# EAGLE design ap (EAGLE 6.0)
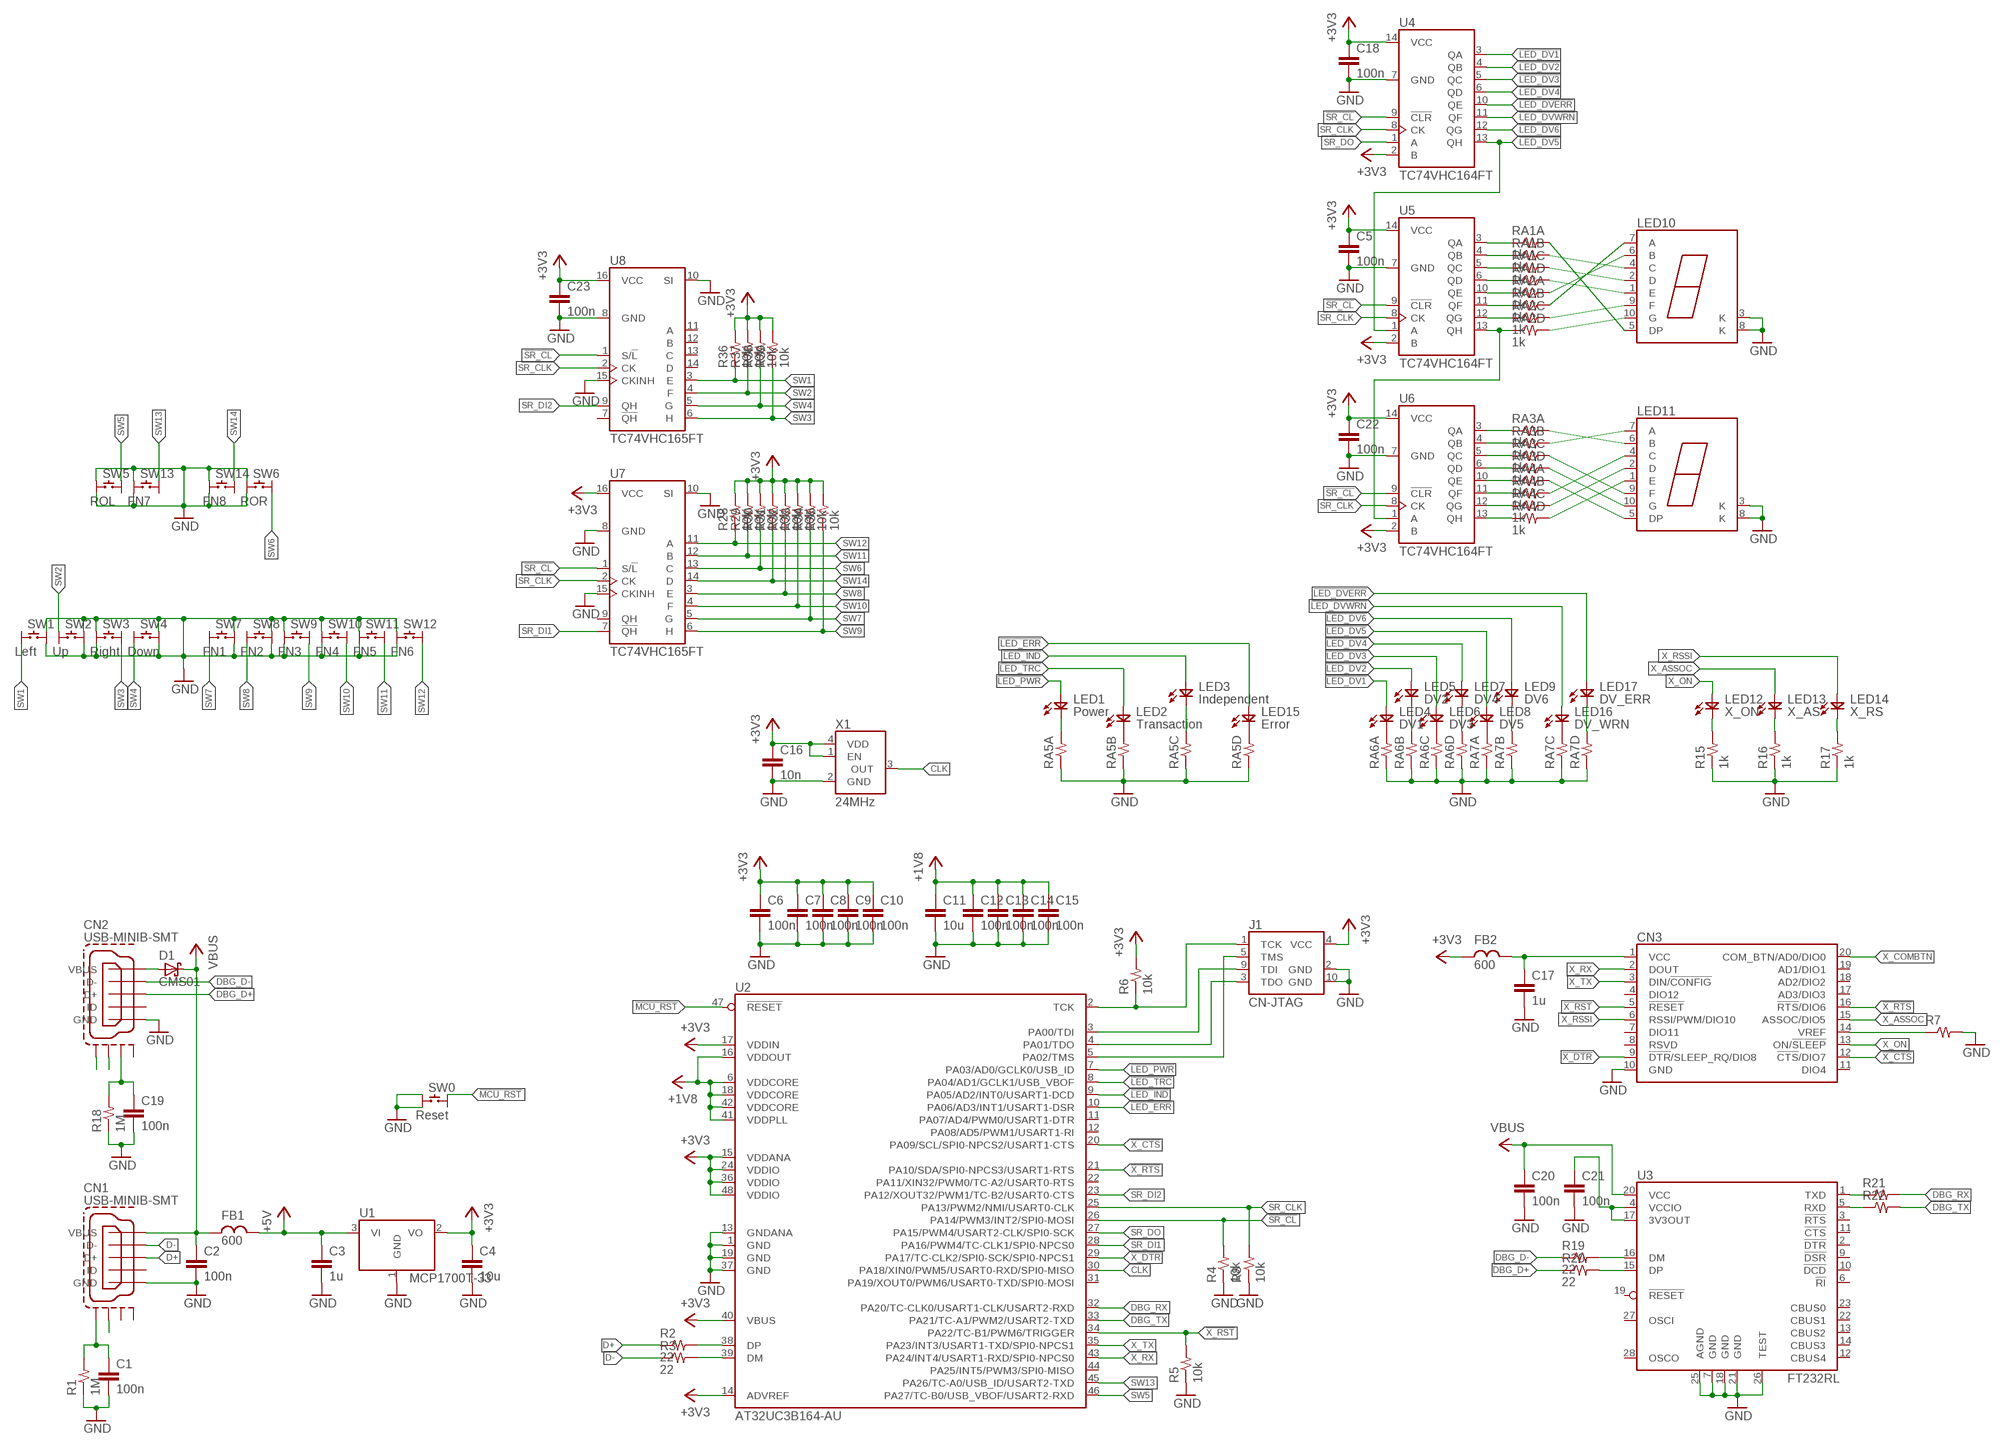
[diagram p0: schematic, sheet 1]

## Parts
C1  100n  C1608  [1608]
C2  100n  C1608  [1608]
C3  1u  C1608  [1608]
C4  10u  C2012  [2012]
C5  100n  C1005  [1005]
C6  100n  C1005  [1005]
C7  100n  C1005  [1005]
C8  100n  C1005  [1005]
C9  100n  C1005  [1005]
C10  100n  C1005  [1005]
C11  10u  C2012  [2012]
C12  100n  C1005  [1005]
C13  100n  C1005  [1005]
C14  100n  C1005  [1005]
C15  100n  C1005  [1005]
C16  10n  C1005  [1005]
C17  1u  C1608  [1608]
C18  100n  C1005  [1005]
C19  100n  C1608  [1608]
C20  100n  C1608  [1608]
C21  100n  C1608  [1608]
C22  100n  C1005  [1005]
C23  100n  C1005  [1005]
CN1  USB-MINIB-SMT  [USB-MINIB-SMT]
CN2  USB-MINIB-SMT  [USB-MINIB-SMT]
CN3  XBEE-SMT  [XBEE-SMT]
D1  CMS01  [3-4E1A]
FB1  600  FB1608  [1608]
FB2  600  FB1608  [1608]
J1  CN-JTAG  CN-JTAG_ALTERA  [PIN2X5]
LED1  Power  LED1608  [LED1608]
LED2  Transaction  LED1608  [LED1608]
LED3  Independent  LED1608  [LED1608]
LED4  DV1  LED1608  [LED1608]
LED5  DV2  LED1608  [LED1608]
LED6  DV3  LED1608  [LED1608]
LED7  DV4  LED1608  [LED1608]
LED8  DV5  LED1608  [LED1608]
LED9  DV6  LED1608  [LED1608]
LED10  ACSC02  [ACSC02]
LED11  ACSC02  [ACSC02]
LED12  X_ON  LED1608  [LED1608]
LED13  X_AS  LED1608  [LED1608]
LED14  X_RS  LED1608  [LED1608]
LED15  Error  LED1608  [LED1608]
LED16  DV_WRN  LED1608  [LED1608]
LED17  DV_ERR  LED1608  [LED1608]
R1  1M  R1608  [1608]
R2  22  R1608  [1608]
R3  22  R1608  [1608]
R4  10k  R1005  [1005]
R5  10k  R1005  [1005]
R6  10k  R1005  [1005]
R7  R1608  [1608]
R8  10k  R1005  [1005]
R15  1k  R1608  [1608]
R16  1k  R1608  [1608]
R17  1k  R1608  [1608]
R18  1M  R1608  [1608]
R19  22  R1608  [1608]
R20  22  R1608  [1608]
R21  R1608  [1608]
R22  R1608  [1608]
R28  10k  R1005  [1005]
R29  10k  R1005  [1005]
R30  10k  R1005  [1005]
R31  10k  R1005  [1005]
R32  10k  R1005  [1005]
R33  10k  R1005  [1005]
R34  10k  R1005  [1005]
R35  10k  R1005  [1005]
R36  10k  R1005  [1005]
R37  10k  R1005  [1005]
R38  10k  R1005  [1005]
R39  10k  R1005  [1005]
RA1  1k  RA4  [1005-A4]
RA2  1k  RA4  [1005-A4]
RA3  1k  RA4  [1005-A4]
RA4  1k  RA4  [1005-A4]
RA5  RA4  [1005-A4]
RA6  RA4  [1005-A4]
RA7  RA4  [1005-A4]
SW0  Reset  TACT4P-SMT6660  [TACT4P-SMT6660]
SW1  Left  TACT4P-SMT-6660  [TACT4P-SMT-6660]
SW2  Up  TACT4P-SMT-6660  [TACT4P-SMT-6660]
SW3  Right  TACT4P-SMT-6660  [TACT4P-SMT-6660]
SW4  Down  TACT4P-SMT-6660  [TACT4P-SMT-6660]
SW5  ROL  TACT4P-SMT-4735R  [TACT4P-SMT-4735R]
SW6  ROR  TACT4P-SMT-4735R  [TACT4P-SMT-4735R]
SW7  FN1  TACT4P-SMT-6660  [TACT4P-SMT-6660]
SW8  FN2  TACT4P-SMT-6660  [TACT4P-SMT-6660]
SW9  FN3  TACT4P-SMT-6660  [TACT4P-SMT-6660]
SW10  FN4  TACT4P-SMT-6660  [TACT4P-SMT-6660]
SW11  FN5  TACT4P-SMT-6660  [TACT4P-SMT-6660]
SW12  FN6  TACT4P-SMT-6660  [TACT4P-SMT-6660]
SW13  FN7  TACT4P-SMT-4735R  [TACT4P-SMT-4735R]
SW14  FN8  TACT4P-SMT-4735R  [TACT4P-SMT-4735R]
U1  MCP1700T-33  [SOT23-3]
U2  AT32UC3B164-AU  [QFP48-0.5]
U3  FT232RL  [SSOP28]
U4  TC74VHC164FT  [TSSOP14]
U5  TC74VHC164FT  [TSSOP14]
U6  TC74VHC164FT  [TSSOP14]
U7  TC74VHC165FT  [TSSOP16]
U8  TC74VHC165FT  [TSSOP16]
X1  24MHz  ASDM  [OSC2520]

## Nets
!LED_DV1: LED4.A U4.3(QA)
!LED_DV2: LED5.A U4.4(QB)
!LED_DV3: LED6.A U4.5(QC)
!LED_DV4: LED7.A U4.6(QD)
!LED_DV5: LED8.A U4.13(QH) U5.1(A)
!LED_DV6: LED9.A U4.12(QG)
!LED_DVERR: LED17.A U4.10(QE)
!LED_DVWRN: LED16.A U4.11(QF)
!LED_ERR: LED15.A U2.10(PA06/AD3/INT1/USART1-DSR)
!LED_IND: LED3.A U2.9(PA05/AD2/INT0/USART1-DCD)
!LED_PWR: LED1.A U2.7(PA03/AD0/GCLK0/USB_ID)
!LED_TRC: LED2.A U2.8(PA04/AD1/GCLK1/USB_VBOF)
!MCU_RST: SW0.B1 U2.47(!RESET)
!SR_CL: R4.2 U2.26(PA14/PWM3/INT2/SPI0-MOSI) U4.9(!CLR) U5.9(!CLR) U6.9(!CLR) U7.1(S/!L) U8.1(S/!L)
!X_CTS: CN3.12(!CTS!/DIO7) U2.20(PA09/SCL/SPI0-NPCS2/USART1-CTS)
!X_DTR: CN3.9(!DTR!/SLEEP_RQ/DIO8) U2.29(PA17/TC-CLK2/SPI0-SCK/SPI0-NPCS1)
!X_RST: CN3.5(!RESET) R5.2 U2.34(PA22/TC-B1/PWM6/TRIGGER)
!X_RTS: CN3.16(!RTS!/DIO6) U2.21(PA10/SDA/SPI0-NPCS3/USART1-RTS)
+1V8: C11.1 C12.1 C13.1 C14.1 C15.1 U2.6(VDDCORE) U2.16(VDDOUT) U2.18(VDDCORE) U2.41(VDDPLL) U2.42(VDDCORE)
+3V3: C4.1 C5.1 C6.1 C7.1 C8.1 C9.1 C10.1 C16.1 C18.1 C22.1 C23.1 FB2.1 J1.4(VCC) R6.2 R28.2 R29.2 R30.2 R31.2 R32.2 R33.2 R34.2 R35.2 R36.2 R37.2 R38.2 R39.2 U1.2(VO) U2.14(ADVREF) U2.15(VDDANA) U2.17(VDDIN) U2.24(VDDIO) U2.36(VDDIO) U2.40(VBUS) U2.48(VDDIO) U4.2(B) U4.14(VCC) U5.2(B) U5.14(VCC) U6.2(B) U6.14(VCC) U7.16(VCC) U8.16(VCC) X1.1(EN) X1.4(VDD)
+5V: C3.1 FB1.2 U1.3(VI)
CLK: U2.30(PA18/XIN0/PWM5/USART0-RXD/SPI0-MISO) X1.3(OUT)
D+: CN1.3(D+) R2.1
D-: CN1.2(D-) R3.1
DBG_D+: CN2.3(D+) R20.1
DBG_D-: CN2.2(D-) R19.1
DBG_RX: R21.2 U2.32(PA20/TC-CLK0/USART1-CLK/USART2-RXD)
DBG_TX: R22.2 U2.33(PA21/TC-A1/PWM2/USART2-TXD)
GND: C1.2 C2.2 C3.2 C4.2 C5.2 C6.2 C7.2 C8.2 C9.2 C10.2 C11.2 C12.2 C13.2 C14.2 C15.2 C16.2 C17.2 C18.2 C19.2 C20.2 C21.2 C22.2 C23.2 CN1.5(GND) CN2.5(GND) CN3.10(GND) J1.2(GND) J1.10(GND) LED10.3(K) LED10.8(K) LED11.3(K) LED11.8(K) R1.1 R4.1 R5.1 R7.2 R8.1 R15.1 R16.1 R17.1 R18.1 RA5.A1 RA5.B1 RA5.C1 RA5.D1 RA6.A1 RA6.B1 RA6.C1 RA6.D1 RA7.A1 RA7.B1 RA7.C1 RA7.D1 SW0.A1 SW0.A2 SW1.B1 SW1.B2 SW2.B1 SW2.B2 SW3.A1 SW3.A2 SW4.B1 SW4.B2 SW5.A1 SW5.A2 SW6.A1 SW6.A2 SW7.B1 SW7.B2 SW8.B1 SW8.B2 SW9.A1 SW9.A2 SW10.A1 SW10.A2 SW11.A1 SW11.A2 SW12.A1 SW12.A2 SW13.A1 SW13.A2 SW14.A1 SW14.A2 U1.1(GND) U2.1(GND) U2.13(GNDANA) U2.19(GND) U2.37(GND) U3.7(GND) U3.18(GND) U3.21(GND) U3.25(AGND) U3.26(TEST) U4.7(GND) U5.7(GND) U6.7(GND) U7.8(GND) U7.10(SI) U7.15(CKINH) U8.8(GND) U8.10(SI) U8.15(CKINH) X1.2(GND)
N$1: R2.2 U2.38(DP)
N$2: C1.1 CN1.S1 R1.2
N$3: R21.1 U3.1(TXD)
N$4: R3.2 U2.39(DM)
N$5: LED10.6(B) RA2.A2
N$6: CN3.14(VREF) R7.1
N$7: LED10.7(A) RA2.B2
N$8: J1.1(TCK) R6.1 U2.2(TCK)
N$9: J1.9(TDI) U2.3(PA00/TDI)
N$10: LED9.C RA7.B2
N$11: LED10.9(F) RA2.C2
N$12: LED2.C RA5.B2
N$13: LED1.C RA5.A2
N$14: LED4.C RA6.A2
N$15: LED5.C RA6.B2
N$16: LED6.C RA6.C2
N$17: R22.1 U3.5(RXD)
N$18: LED7.C RA6.D2
N$19: LED8.C RA7.A2
N$20: LED12.C R15.2
N$21: LED13.C R16.2
N$22: LED14.C R17.2
N$23: R19.2 U3.16(DM)
N$24: R20.2 U3.15(DP)
N$25: C21.1 U3.4(VCCIO) U3.17(3V3OUT)
N$26: CN2.1(VBUS) D1.A
N$27: J1.3(TDO) U2.4(PA01/TDO)
N$28: C19.1 CN2.S3 R18.2
N$29: LED10.10(G) RA2.D2
N$30: LED10.5(DP) RA1.A2
N$31: LED15.C RA5.D2
N$32: RA1.A1 U5.3(QA)
N$33: C17.1 CN3.1(VCC) FB2.2
N$34: LED3.C RA5.C2
N$35: LED10.4(C) RA1.B2
N$36: LED10.2(D) RA1.C2
N$37: LED10.1(E) RA1.D2
N$38: LED11.10(G) RA3.D2
N$39: LED11.9(F) RA3.C2
N$40: LED11.7(A) RA3.B2
N$41: LED11.6(B) RA3.A2
N$42: LED11.1(E) RA4.D2
N$43: LED16.C RA7.C2
N$44: RA1.B1 U5.4(QB)
N$45: RA1.C1 U5.5(QC)
N$46: RA1.D1 U5.6(QD)
N$47: RA2.A1 U5.10(QE)
N$48: RA2.B1 U5.11(QF)
N$49: RA2.C1 U5.12(QG)
N$50: RA2.D1 U5.13(QH) U6.1(A)
N$51: LED11.2(D) RA4.C2
N$52: LED11.4(C) RA4.B2
N$53: LED11.5(DP) RA4.A2
N$54: CN2.S1
N$55: CN2.S2
N$57: CN1.S2
N$59: RA3.A1 U6.3(QA)
N$60: RA3.B1 U6.4(QB)
N$61: RA3.C1 U6.5(QC)
N$62: RA3.D1 U6.6(QD)
N$63: RA4.A1 U6.10(QE)
N$64: RA4.B1 U6.11(QF)
N$65: RA4.C1 U6.12(QG)
N$66: RA4.D1 U6.13(QH)
N$75: LED17.C RA7.D2
N$100: J1.5(TMS) U2.5(PA02/TMS)
SR_CLK: R8.2 U2.25(PA13/PWM2/NMI/USART0-CLK) U4.8(CK) U5.8(CK) U6.8(CK) U7.2(CK) U8.2(CK)
SR_DI1: U2.28(PA16/PWM4/TC-CLK1/SPI0-NPCS0) U7.7(!QH)
SR_DI2: U2.23(PA12/XOUT32/PWM1/TC-B2/USART0-CTS) U8.9(QH)
SR_DO: U2.27(PA15/PWM4/USART2-CLK/SPI0-SCK) U4.1(A)
SW1: R36.1 SW1.A2 U8.3(E)
SW2: R37.1 SW2.A1 U8.4(F)
SW3: R39.1 SW3.B2 U8.6(H)
SW4: R38.1 SW4.A2 U8.5(G)
SW5: SW5.B1 U2.46(PA27/TC-B0/USB_VBOF/USART2-RXD)
SW6: R30.1 SW6.B2 U7.13(C)
SW7: R34.1 SW7.A2 U7.5(G)
SW8: R32.1 SW8.A2 U7.3(E)
SW9: R35.1 SW9.B2 U7.6(H)
SW10: R33.1 SW10.B2 U7.4(F)
SW11: R29.1 SW11.B2 U7.12(B)
SW12: R28.1 SW12.B2 U7.11(A)
SW13: SW13.B1 U2.45(PA26/TC-A0/USB_ID/USART2-TXD)
SW14: R31.1 SW14.B1 U7.14(D)
VBUS: C2.1 C20.1 CN1.1(VBUS) D1.C FB1.1 U3.20(VCC)
X_ASSOC: CN3.15(ASSOC/DIO5) LED13.A
X_COMBTN: CN3.20(COM_BTN/AD0/DIO0)
X_ON: CN3.13(ON/!SLEEP) LED12.A
X_RSSI: CN3.6(RSSI/PWM/DIO10) LED14.A
X_RX: CN3.2(DOUT) U2.43(PA24/INT4/USART1-RXD/SPI0-NPCS0)
X_TX: CN3.3(DIN/!CONFIG) U2.35(PA23/INT3/USART1-TXD/SPI0-NPCS1)
Unconnected: CN1.4(ID) CN1.S3 CN1.S4 CN2.4(ID) CN2.S4 CN3.4(DIO12) CN3.7(DIO11) CN3.8(RSVD) CN3.11(DIO4) CN3.17(AD3/DIO3) CN3.18(AD2/DIO2) CN3.19(AD1/DIO1) SW0.B2 SW1.A1 SW2.A2 SW3.B1 SW4.A1 SW5.B2 SW6.B1 SW7.A1 SW8.A1 SW9.B1 SW10.B1 SW11.B1 SW12.B1 SW13.B2 SW14.B2 U2.11(PA07/AD4/PWM0/USART1-DTR) U2.12(PA08/AD5/PWM1/USART1-RI) U2.22(PA11/XIN32/PWM0/TC-A2/USART0-RTS) U2.31(PA19/XOUT0/PWM6/USART0-TXD/SPI0-MOSI) U2.44(PA25/INT5/PWM3/SPI0-MISO) U3.2(!DTR) U3.3(!RTS) U3.6(!RI) U3.9(!DSR) U3.10(!DCD) U3.11(!CTS) U3.12(CBUS4) U3.13(CBUS2) U3.14(CBUS3) U3.19(!RESET) U3.22(CBUS1) U3.23(CBUS0) U3.27(OSCI) U3.28(OSCO) U7.9(QH) U8.7(!QH) U8.11(A) U8.12(B) U8.13(C) U8.14(D)

## Library data of the parts
C1-C23 = Passive:C
CN1 CN2 = Connector:USB-MINIB-SMT
CN3 = Connector:XBEE-*
D1 = Diode:CMS*
FB1 FB2 = Passive:FB
J1 = Connector:CN-JTAG_ALTERA
LED1-LED9 LED12-LED17 = Passive:LED
LED10 LED11 = Opto:ACSC02
R1-R8 R15-R22 R28-R39 = Passive:R
RA1-RA7 = Passive:RA4
SW0 = Switch:TACT4P-SMT
SW1-SW14 = Switch:TACT4P-SMT-*
U1 = ic-Microchip:MCP1700T-*
U2 = ic-ATMEL:AT32UC3B1*
U3 = ic-FTDI:FT232R
U4-U6 = ic-Toshiba:TC74VHC164F
U7 U8 = ic-Toshiba:TC74VHC165F
X1 = Oscillator:ASDM

## Board
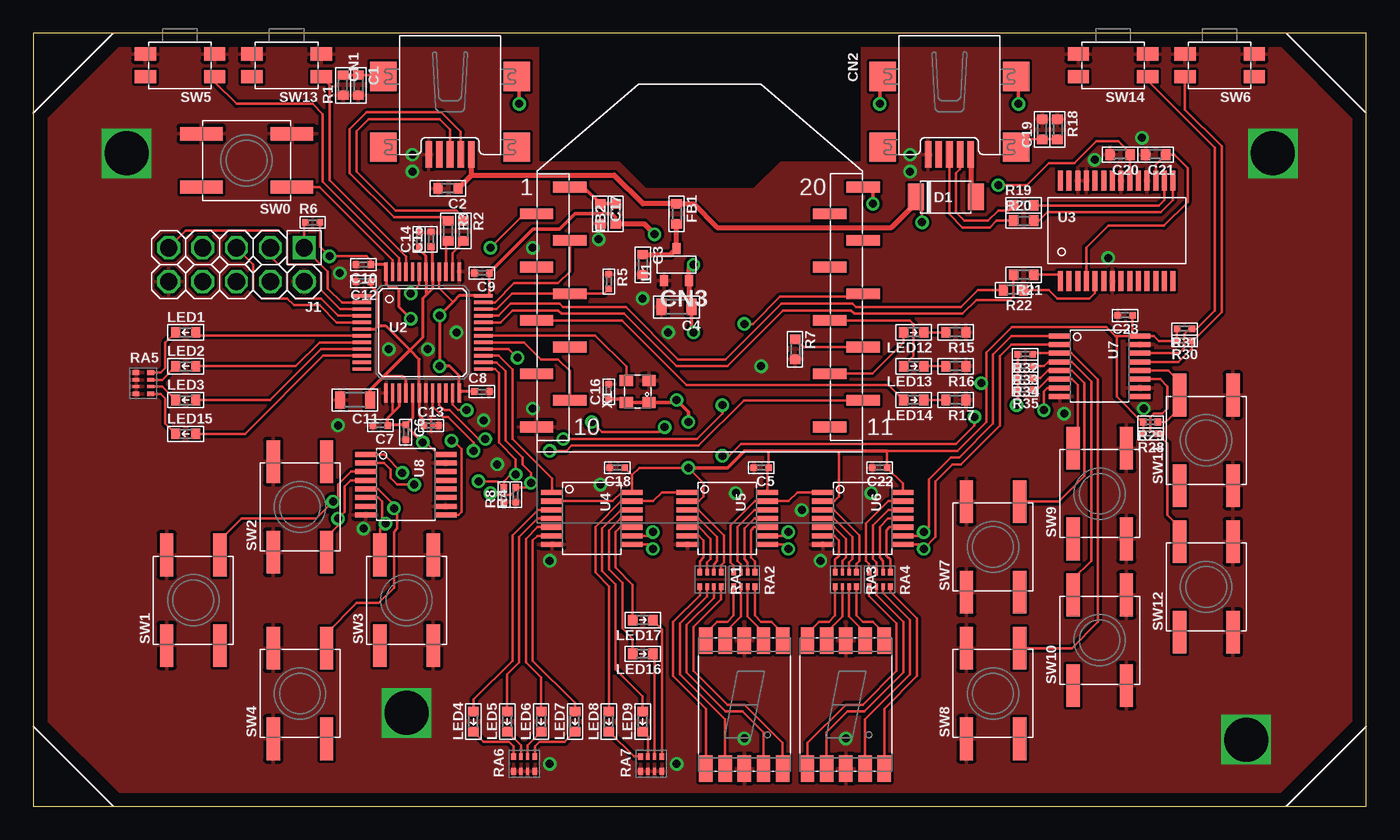
[diagram p1: board, top side]
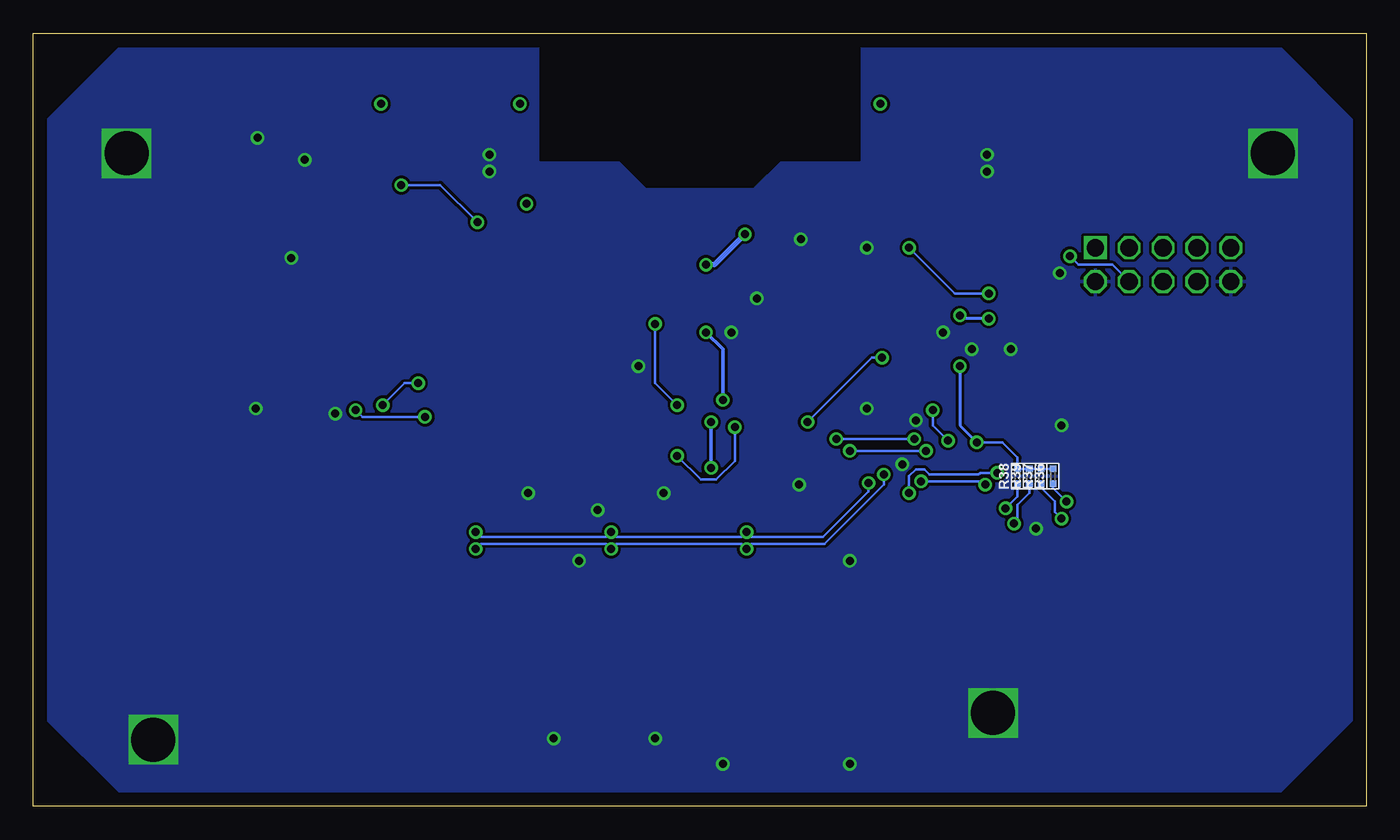
[diagram p2: board, bottom side, seen from below]

Size 100 x 58 mm. Coordinates in mm from the lower left corner, seen from the top.
Outline: 0,0 100,0 100,58 0,58 0,0
Copper layers (1*16): Top 0.035mm / dielectric 1.5mm / Bottom 0.035mm
Design rules: minimum track width 8mil, minimum drill 0.6mm, track to track 8mil, track to pad 8mil, pad to pad 8mil, via to via 8mil, smd to smd 8mil, copper to edge 40mil, drill to drill 8mil, minimum pad ring 8mil, minimum via ring 8mil, stop-mask expansion 2mil, vias tented up to drill 0.6mm, thermal gap 10mil
tRestrict: 7 lines
bRestrict: 7 lines

### Footprints (pad centres in the part's own frame; a part is rotated, then mirrored left to right if it is on the bottom)
1608 = smd 0.7 x 0.8: 1 -0.75,0; 2 0.75,0
2012 = smd 0.75 x 1.25: 1 -1.125,0; 2 1.125,0
1005 = smd 0.5 x 0.5: 1 -0.555,0; 2 0.555,0
USB-MINIB-SMT = smd 2 x 0.5: 1 2.55,1.6; 2 2.55,0.8; 3 2.55,0; 4 2.55,-0.8; 5 2.55,-1.6 | smd 2.2 x 2: S1 -3.3,-5; S2 -3.3,5; S3 2,5; S4 2,-5
XBEE-SMT = smd 2.5 x 0.8: 1 -9.75,9; 2 -12.25,7; 3 -9.75,5; 4 -12.25,3; 5 -9.75,1; 6 -12.25,-1; 7 -9.75,-3; 8 -12.25,-5; 9 -9.75,-7; 10 -12.25,-9; 11 9.75,-9; 12 12.25,-7; 13 9.75,-5; 14 12.25,-3; 15 9.75,-1; 16 12.25,1; 17 9.75,3; 18 12.25,5; 19 9.75,7; 20 12.25,9
3-4E1A = smd 1.2 x 2: A 2.25,0; C -2.25,0
PIN2X5 = drill 1.3 square: 1 -5.08,-1.27 | drill 1.3 octagon: 2 -5.08,1.27; 3 -2.54,-1.27; 4 -2.54,1.27; 5 0,-1.27; 6 0,1.27; 7 2.54,-1.27; 8 2.54,1.27; 9 5.08,-1.27; 10 5.08,1.27
LED1608 = smd 0.7 x 0.8: A 0.75,0; C -0.75,0
ACSC02 = smd 1 x 2: 1 -2.88,-4.8; 2 -1.44,-4.8; 3 0,-4.8; 4 1.44,-4.8; 5 2.88,-4.8; 6 2.88,4.8; 7 1.44,4.8; 8 0,4.8; 9 -1.44,4.8; 10 -2.88,4.8
1005-A4 = smd 0.5 x 0.35: A1 -0.555,0.8; A2 0.555,0.8; D1 -0.555,-0.8; D2 0.555,-0.8 | smd 0.5 x 0.25: B1 -0.555,0.25; B2 0.555,0.25; C1 -0.555,-0.25; C2 0.555,-0.25
TACT4P-SMT6660 = smd 3.2 x 1: A1 -3.4,-2; A2 3.4,-2; B1 -3.4,2; B2 3.4,2
TACT4P-SMT-6660 = smd 3.2 x 1: A1 -3.4,-2; A2 3.4,-2; B1 -3.4,2; B2 3.4,2
TACT4P-SMT-4735R = smd 1.6 x 1: A1 -2.6,-0.85; A2 2.6,-0.85; B1 -2.6,0.85; B2 2.6,0.85
SOT23-3 = smd 0.6 x 0.8: 1 -0.95,-1.2; 2 0.95,-1.2; 3 0,1.2
QFP48-0.5 = smd 1.4 x 0.25: 1 -4.55,2.75; 2 -4.55,2.25; 3 -4.55,1.75; 4 -4.55,1.25; 5 -4.55,0.75; 6 -4.55,0.25; 7 -4.55,-0.25; 8 -4.55,-0.75; 9 -4.55,-1.25; 10 -4.55,-1.75; 11 -4.55,-2.25; 12 -4.55,-2.75; 25 4.55,-2.75; 26 4.55,-2.25; 27 4.55,-1.75; 28 4.55,-1.25; 29 4.55,-0.75; 30 4.55,-0.25; 31 4.55,0.25; 32 4.55,0.75; 33 4.55,1.25; 34 4.55,1.75; 35 4.55,2.25; 36 4.55,2.75 | smd 0.25 x 1.4: 13 -2.75,-4.55; 14 -2.25,-4.55; 15 -1.75,-4.55; 16 -1.25,-4.55; 17 -0.75,-4.55; 18 -0.25,-4.55; 19 0.25,-4.55; 20 0.75,-4.55; 21 1.25,-4.55; 22 1.75,-4.55; 23 2.25,-4.55; 24 2.75,-4.55; 37 2.75,4.55; 38 2.25,4.55; 39 1.75,4.55; 40 1.25,4.55; 41 0.75,4.55; 42 0.25,4.55; 43 -0.25,4.55; 44 -0.75,4.55; 45 -1.25,4.55; 46 -1.75,4.55; 47 -2.25,4.55; 48 -2.75,4.55
SSOP28 = smd 0.381 x 1.5: 1 -4.225,-3.756; 2 -3.575,-3.756; 3 -2.925,-3.756; 4 -2.275,-3.756; 5 -1.625,-3.756; 6 -0.975,-3.756; 7 -0.325,-3.756; 8 0.325,-3.756; 9 0.975,-3.756; 10 1.625,-3.756; 11 2.275,-3.756; 12 2.925,-3.756; 13 3.575,-3.756; 14 4.225,-3.756; 15 4.225,3.756; 16 3.575,3.756; 17 2.925,3.756; 18 2.275,3.756; 19 1.625,3.756; 20 0.975,3.756; 21 0.325,3.756; 22 -0.325,3.756; 23 -0.975,3.756; 24 -1.625,3.756; 25 -2.275,3.756; 26 -2.925,3.756; 27 -3.575,3.756; 28 -4.225,3.756
TSSOP14 = smd 0.381 x 1.6: 1 -1.95,-3; 2 -1.3,-3; 3 -0.65,-3; 4 0,-3; 5 0.65,-3; 6 1.3,-3; 7 1.95,-3; 8 1.95,3; 9 1.3,3; 10 0.65,3; 11 0,3; 12 -0.65,3; 13 -1.3,3; 14 -1.95,3
TSSOP16 = smd 0.381 x 1.6: 1 -2.275,-3; 2 -1.625,-3; 3 -0.975,-3; 4 -0.325,-3; 5 0.325,-3; 6 0.975,-3; 7 1.625,-3; 8 2.275,-3; 9 2.275,3; 10 1.625,3; 11 0.975,3; 12 0.325,3; 13 -0.325,3; 14 -0.975,3; 15 -1.625,3; 16 -2.275,3
OSC2520 = smd 0.8 x 1: 1 -0.825,-0.85; 2 0.825,-0.85; 3 0.825,0.85; 4 -0.825,0.85

### Placement (x,y rotation side)
C1  24.38,54.1 270 top
C2  31.11,46.35 180 top
C3  45.72,40.64 270 top
C4  48.26,37.47 180 top
C5  54.61,25.4 180 top
C6  27.94,28.07 270 top
C7  26.04,28.57 180 top
C8  33.66,31.11 0 top
C9  33.66,40.01 180 top
C10  24.77,40.64 180 top
C11  24.13,30.48 180 top
C12  24.77,39.37 180 top
C13  29.84,28.57 0 top
C14  28.96,42.55 90 top
C15  29.84,42.55 90 top
C16  43.18,31.11 90 top
C17  42.55,44.45 270 top
C18  43.81,25.4 180 top
C19  75.69,50.8 90 top
C20  81.53,48.9 180 top
C21  84.2,48.9 180 top
C22  63.5,25.4 180 top
C23  81.92,36.83 180 top
CN1  31.27,51.46 270 top
CN2  68.73,51.46 270 top
CN3  50,37.46 0 top
D1  68.45,45.72 0 top
FB1  48.26,44.45 270 top
FB2  43.69,44.45 90 top
J1  15.24,40.64 180 top
LED1  11.43,35.56 0 top
LED2  11.43,33.02 0 top
LED3  11.43,30.48 0 top
LED4  33.02,6.35 90 top
LED5  35.56,6.35 90 top
LED6  38.1,6.35 90 top
LED7  40.64,6.35 90 top
LED8  43.18,6.35 90 top
LED9  45.72,6.35 90 top
LED10  53.34,7.62 0 top
LED11  60.96,7.62 0 top
LED12  66.04,35.56 180 top
LED13  66.04,33.02 180 top
LED14  66.04,30.48 180 top
LED15  11.43,27.94 0 top
LED16  45.72,11.43 180 top
LED17  45.72,13.97 180 top
R1  23.24,54.1 90 top
R2  32.26,43.18 270 top
R3  31.11,43.18 270 top
R4  36.2,23.37 90 top
R5  43.18,39.37 270 top
R6  20.95,43.81 0 top
R7  57.15,34.29 270 top
R8  35.31,23.37 90 top
R15  69.22,35.56 180 top
R16  69.22,33.02 180 top
R17  69.22,30.48 180 top
R18  76.83,50.8 270 top
R19  74.3,45.09 0 top
R20  74.3,43.94 0 top
R21  74.3,39.88 180 top
R22  73.53,38.73 180 top
R28  83.82,27.94 180 top
R29  83.82,28.83 180 top
R30  86.36,34.92 180 top
R31  86.36,35.81 180 top
R32  74.42,33.91 180 top
R33  74.42,33.02 180 top
R34  74.42,32.13 180 top
R35  74.42,31.24 180 top
R36  23.5,24.77 90 bottom
R37  24.38,24.77 90 bottom
R38  26.16,24.77 90 bottom
R39  25.27,24.77 90 bottom
RA1  50.8,17.02 270 top
RA2  53.34,17.02 270 top
RA3  60.96,17.02 270 top
RA4  63.5,17.02 270 top
RA5  8.26,31.75 0 top
RA6  36.83,3.17 90 top
RA7  46.35,3.17 90 top
SW0  16,48.46 180 top
SW1  12,15.46 90 top
SW2  20,22.46 90 top
SW3  28,15.46 90 top
SW4  20,8.46 90 top
SW5  11,55.59 180 top
SW6  89,55.59 180 top
SW7  72,19.46 90 top
SW8  72,8.46 90 top
SW9  80,23.46 90 top
SW10  80,12.46 90 top
SW11  88,27.46 90 top
SW12  88,16.46 90 top
SW13  19,55.59 180 top
SW14  81,55.59 180 top
U1  48.26,40.64 0 top
U2  29.21,35.56 0 top
U3  81.28,43.18 0 top
U4  41.91,21.59 270 top
U5  52.07,21.59 270 top
U6  62.23,21.59 270 top
U7  80.01,33.02 270 top
U8  27.94,24.13 270 top
X1  45.34,31.11 90 top

### Tracks (layer width: path | path; a pad name or v marks a point on that pad's centre or on a via)
!LED_DV1
  Top 0.203: U4.3 37.86,22.24 35.94,20.32 35.94,10.92 33.02,8 LED4.A
!LED_DV2
  Top 0.203: U4.4 37.85,21.59 36.45,20.19 36.45,10.79 35.56,9.91 LED5.A
!LED_DV3
  Top 0.203: U4.5 37.83,20.94 36.96,20.07 36.96,10.79 38.1,9.65 LED6.A
!LED_DV4
  Top 0.203: U4.6 37.82,20.29 37.47,19.94 37.47,10.92 40.64,7.75 LED7.A
!LED_DV5
  Top 0.203: U5.1 47.16,23.54 46.51,22.89 U4.13 44.1,22.89 42.16,20.95 42.16,17.53 43.18,16.51 LED8.A
!LED_DV6
  Top 0.203: LED9.A 45.72,8.26 43.69,10.29 43.69,16.64 42.67,17.65 42.67,20.83 44.08,22.24 U4.12
!LED_DVERR
  Top 0.203: LED17.A 44.97,16.62 43.69,17.91 43.69,20.57 44.05,20.94 U4.10
!LED_DVWRN
  Top 0.203: LED16.A 44.97,12.56 44.2,13.34 44.2,16.76 43.18,17.78 43.18,20.7 44.07,21.59 U4.11
!LED_ERR
  Top 0.203: U2.10 21.75,33.81 15.88,27.94 LED15.A
!LED_IND
  Top 0.203: U2.9 21.61,34.31 17.78,30.48 LED3.A
!LED_PWR
  Top 0.203: U2.7 12.43,35.31 LED1.A
!LED_TRC
  Top 0.203: LED2.A 19.68,33.02 21.48,34.81 U2.8
!MCU_RST
  Top 0.203: U2.47 26.96,40.98 21.48,46.46 SW0.B1
!SR_CL  (via drill 0.6)
  Top 0.203: U2.26 34.76,33.31 35.43,32.64 35.43,27.43 36.7,26.16 36.7,25.65 37.34,25.02 v37.34,24.26 37,23.92 R4.2 36.2,23.75 35.81,23.37 34.42,23.37 v34.29,23.5 | U8.1 26.3,26.41 v27.69,25.02 | U7.1 73.39,35.3 72.01,33.91 72.01,28.7 69.47,26.16 68.83,26.16 67.18,24.51 67.18,20.95 v66.8,20.57 66.52,20.29 U6.9 | U5.9 56.36,20.29 v56.64,20.57 | U4.9 46.2,20.29 v46.48,20.57
  Bottom 0.203: v34.29,23.5 34.29,24.77 33.78,25.27 33.15,25.27 32.77,24.89 29.08,24.89 28.96,25.02 v27.69,25.02 | v66.8,20.57 66.42,20.19 57.02,20.19 v56.64,20.57 56.26,20.19 46.86,20.19 v46.48,20.57 46.1,20.19 40.77,20.19 37.34,23.62 v37.34,24.26
!X_CTS  (via drill 0.6)
  Top 0.203: v38.73,26.67 40.01,26.67 40.39,27.05 49.91,27.05 53.32,30.46 CN3.12 | U2.20 29.96,29.98 30.73,29.21 31.11,29.21 33.02,27.3 v33.02,26.67
  Bottom 0.203: v33.02,26.67 v38.73,26.67
!X_DTR
  Top 0.203: U2.29 36.82,34.81 38.1,33.53 39.37,33.53 40.25,32.65 CN3.9
!X_RST
  Top 0.203: U2.34 34.77,37.31 35.92,38.46 CN3.5 42.83,38.46 R5.2
!X_RTS  (via drill 0.6)
  Top 0.203: v39.75,27.56 49.78,27.56 51.69,29.46 v51.69,30.1 | CN3.16 62.02,38.23 56.01,38.23 53.98,36.2 v53.34,36.2 | U2.21 30.46,30.12 30.86,29.72 31.24,29.72 33.4,27.56 v33.91,27.56
  Bottom 0.203: v33.91,27.56 v39.75,27.56 | v53.34,36.2 53.34,31.75 v51.69,30.1
+1V8
  Top 0.229: C15.1 29.96,41.88 U2.41 29.96,38.85 29.46,38.35 | C14.1 28.96,41.78 29.46,41.28 U2.42 29.46,38.35 | U2.6 25.65,35.81 25.91,36.07 | C13.1 29.29,29 28.96,29.33 U2.18 28.96,33.52 28.26,34.23 | 25.91,36.07 26.42,36.07 28.26,34.23 | 29.46,38.35 29.21,38.1 29.21,35.18 28.26,34.23 | U2.16 27.96,31.98 27.69,32.26 26.29,32.26 | 25.91,36.07 25.91,38.48 25.32,39.07 C12.1
  Top 0.254: C11.1 25.25,31.22 26.29,32.26 28.26,34.23
+3V3  (via drill 0.6)
  Top 0.203: U2.14 26.96,29.5 26.67,29.21 | U2.40 30.46,38.88 31.5,37.85 | C10.1 25.32,40.97 25.02,41.27 v22.23,41.27 21.51,41.99 R6.2 | v29.21,27.3 29.46,27.3 30.36,26.41 U8.16 | 44.91,24.84 U4.14 44.11,23.54 43.46,22.89 U4.2 | 44.91,24.84 45.47,25.4 v49.15,25.4 50.29,24.26 50.29,23.24 49.94,22.89 U5.2 | C18.1 44.37,25.38 44.91,24.84 | 55.12,26.67 55.16,26.62 C5.1 55.07,25.3 U5.14 | U6.2 60.1,22.89 60.45,23.24 60.45,26.67 | U6.14 65.23,24.23 C22.1 64.06,26.62 64.01,26.67 69.34,26.67 71.5,28.83 71.5,31.75 | 71.5,31.75 71.5,34.04 73.41,35.94 80.52,35.94 81.16,35.3 | U7.16 81.16,35.3 | C23.1 82.47,35.3 U7.16 | R31.2 R30.2 84.45,34.92 84.08,35.3 U7.16 | R32.2 R33.2 R34.2 R35.2 73.87,30.18 v73.79,30.1 | R28.2 R29.2 83.19,28.83 81.28,30.73 81.28,35.18 81.16,35.3 | v71.12,31.75 71.5,31.75
  Top 0.229: C10.1 26.46,40.64 U2.48 26.46,39.2 26.67,38.99 27.18,38.99 27.43,38.73 27.43,37.47 v28.32,36.58 | C8.1 31.96,31.11 U2.24 31.96,32.3 31.24,33.02 v30.48,33.02 v30.48,36.83 31.5,37.85 31.96,38.31 U2.36 34.21,38.31 C9.1 | U2.15 27.46,30 26.67,29.21 26.59,29.13 C7.1 26.64,28.62 C6.1 | v29.21,27.3 27.94,28.57 C6.1 | U2.17 28.46,29.14 C6.1
  Top 0.254: C4.1 49.38,35.7 v49.53,35.56 | v49.15,28.83 49.15,29.59 v48.26,30.48 48.07,30.29 X1.1 X1.4 44.22,30.56 C16.1 | FB2.1 43.69,44.2 43.43,44.45 40.64,44.45 39.5,43.31 37.51,43.31 C9.1 | v49.15,25.4 52.07,25.4 53.34,26.67 55.12,26.67 60.45,26.67 64.01,26.67
  Top 0.381: C4.1 49.21,37.64 U1.2 49.21,40.32 v49.53,40.64 | FB2.1 45.84,43.7 v46.61,42.93
  Bottom 0.203: R36.2 R37.2 R39.2 R38.2 26.16,26.16 27.3,27.3 v29.21,27.3 | J1.4 19.05,40.64 21.59,40.64 v22.23,41.27 | v73.79,30.1 72.14,31.75 v71.12,31.75
  Bottom 0.229: v28.32,36.58 30.23,36.58 v30.48,36.83 | v30.48,33.02 30.48,28.57 v29.21,27.3
  Bottom 0.254: v49.53,35.56 48.26,34.29 v48.26,30.48 | v49.15,28.83 v49.15,25.4
  Bottom 0.381: v46.61,42.93 48.9,40.64 v49.53,40.64
+5V
  Top 0.381: FB1.2 U1.3 47.81,41.39 C3.1
CLK
  Top 0.203: U2.30 42.16,35.31 44.49,32.98 X1.3
D+
  Top 0.203: CN1.3 31.27,50.77 30.48,51.56 25.15,51.56 24.26,50.67 24.26,47.62 27.18,44.7 31.75,44.7 32.26,44.2 R2.1
D-
  Top 0.203: CN1.2 32.07,50.61 30.61,52.07 25.02,52.07 23.75,50.8 23.75,47.5 27.05,44.2 30.85,44.2 R3.1
DBG_D+
  Top 0.203: R20.1 72.26,43.94 71.75,43.43 69.72,43.43 68.73,44.43 CN2.3
DBG_D-
  Top 0.203: R19.1 73.16,44.7 72.39,44.7 71.63,43.94 69.85,43.94 69.22,44.58 69.22,47.5 69.53,47.81 CN2.2
DBG_RX
  Top 0.203: U2.32 35.04,36.31 35.94,37.21 39.37,37.21 39.62,36.96 44.32,36.96 48.26,33.02 52.07,33.02 56.26,37.21 61.34,37.21 61.59,36.96 69.72,36.96 70.74,37.97 73.28,37.97 73.53,38.23 73.53,39.87 R21.2
DBG_TX
  Top 0.203: U2.33 34.91,36.81 35.81,37.72 39.5,37.72 39.75,37.47 44.45,37.47 48.39,33.53 51.94,33.53 56.13,37.72 61.47,37.72 61.72,37.47 69.6,37.47 70.87,38.73 R22.2
GND  (via drill 0.6, 3.3)
  Top 0.203: 29.84,29.08 29.84,28.57 | 29.84,28.57 29.84,28.07 | 29.84,28.57 30.48,28.57
  other vias: 93,49 7,49 91,5 28,7 83.31,29.84 52.7,23.5 54.61,33.02 22.99,40.01 31.75,35.56 26.67,34.29 22.86,28.57 37.47,29.84 80.64,41.15 79.63,48.51 83.19,50.16 77.34,29.46 59.05,18.41 62.87,23.5 57.66,22.23 38.73,18.41 42.55,24.13 38.73,3.17 48.26,3.17 53.34,5.08 60.96,5.08 28.45,47.62 28.45,48.9 65.79,48.9 65.79,47.62 45.72,38.1 47.62,35.56 42.42,42.55 24.77,20.83 33.78,28.96 34.8,25.65 29.59,34.29 37.47,41.91
  pour Bottom: 6.5,57 1,51.5 1,6.5 6.5,1 93.5,1 99,6.5 99,51.5 93.5,57
  pour Top: 6.5,57 1,51.5 1,6.5 6.5,1 93.5,1 99,6.5 99,51.5 93.5,57
N$1
  Top 0.203: U2.38 31.46,41.49 32.26,42.29 R2.2
N$2
  Top 0.203: R1.2 C1.1 26.18,54.85 CN1.S1
N$3
  Top 0.203: R21.1 77.06,39.88 U3.1
N$4
  Top 0.203: U2.39 30.96,42.27 R3.2
N$5
  Top 0.203: RA2.A2 54.14,14.31 54.61,13.84 55.37,13.84 56.22,12.99 LED10.6
N$6
  Top 0.203: CN3.14 57.73,34.46 R7.1
N$7
  Top 0.203: LED10.7 54.86,12.5 54.86,12.96 53.59,14.23 RA2.B2
N$8
  Top 0.203: U2.2 23.15,37.81 22.1,38.86 22.1,40.13 J1.1 20.32,43.73 R6.1
N$9
  Top 0.203: U2.3 23.02,37.31 21.59,38.73 21.59,40.01 20.95,40.64 19.18,40.64 19.05,40.77 19.05,42.55 18.41,43.18 11.43,43.18 J1.9
N$10
  Top 0.203: RA7.B2 46.1,5.21 LED9.C
N$11
  Top 0.203: RA2.C2 53.09,14.23 51.9,13.04 LED10.9
N$12
  Top 0.203: RA5.B2 9.66,32 LED2.C
N$13
  Top 0.203: RA5.A2 9.56,32.55 9.91,32.89 9.91,34.79 LED1.C
N$14
  Top 0.203: RA6.A2 36.03,4.48 35.69,4.83 33.79,4.83 LED4.C
N$15
  Top 0.203: RA6.B2 36.58,4.58 LED5.C
N$16
  Top 0.203: RA6.C2 37.08,4.58 LED6.C
N$17
  Top 0.203: U3.5 79.66,38.51 79.25,38.1 76.83,38.1 76.2,38.73 R22.1
N$18
  Top 0.203: RA6.D2 37.63,4.48 37.97,4.83 39.87,4.83 LED7.C
N$19
  Top 0.203: RA7.A2 45.05,3.73 LED8.C
N$20
  Top 0.203: LED12.C R15.2
N$21
  Top 0.203: LED13.C R16.2
N$22
  Top 0.203: LED14.C R17.2
N$23
  Top 0.203: R19.2 84.45,45.09 84.86,45.48 U3.16
N$24
  Top 0.203: R20.2 75.44,43.94 76.07,44.58 84.58,44.58 85.5,45.5 U3.15
N$25
  Top 0.203: U3.4 79,41.92 80.64,43.56 84.84,43.56 86.61,45.34 86.61,47.88 85.6,48.9 C21.1 84.2,48.15 U3.17
N$26
  Top 0.381: CN2.1 70.33,46.09 D1.A
N$27
  Top 0.203: U2.4 22.88,36.81 21.59,38.1 19.68,38.1 19.05,38.73 19.05,40.01 17.78,41.27 J1.3
N$28
  Top 0.203: CN2.S3 74.32,50.05 C19.1 R18.2
N$29
  Top 0.203: RA2.D2 52.54,14.31 52.07,13.84 51.31,13.84 50.46,12.99 LED10.10
N$30
  Top 0.203: LED10.5 56.22,4.74 53.34,7.62 52.07,7.62 49.53,10.16 49.53,13.46 51.6,15.53 RA1.A2
N$31
  Top 0.203: RA5.D2 9.56,30.95 9.91,30.61 9.91,28.71 LED15.C
N$32
  Top 0.203: U5.3 49.9,22.24 51.82,20.32 51.82,18.29 51.6,18.07 RA1.A1
N$33
  Top 0.254: FB2.2 C17.1 41.28,46.46 CN3.1
N$34
  Top 0.203: RA5.C2 9.66,31.5 LED3.C
N$35
  Top 0.203: LED10.4 54.78,5.54 53.21,7.11 51.94,7.11 49.02,10.03 49.02,13.59 51.05,15.62 RA1.B2
N$36
  Top 0.203: LED10.2 51.9,6.52 48.51,9.91 48.51,13.72 50.55,15.75 RA1.C2
N$37
  Top 0.203: LED10.1 50.46,7.33 48.01,9.78 48.01,13.84 50,15.84 RA1.D2
N$38
  Top 0.203: RA3.D2 60.16,14.31 59.69,13.84 58.93,13.84 58.08,12.99 LED11.10
N$39
  Top 0.203: LED11.9 59.52,13.04 60.71,14.23 RA3.C2
N$40
  Top 0.203: LED11.7 62.4,13.04 61.21,14.23 RA3.B2
N$41
  Top 0.203: RA3.A2 61.76,14.31 62.23,13.84 62.99,13.84 63.84,12.99 LED11.6
N$42
  Top 0.203: RA4.D2 62.7,15.79 64.77,13.72 64.77,10.16 62.23,7.62 60.96,7.62 58.08,4.74 LED11.1
N$43
  Top 0.203: RA7.C2 46.6,11.29 LED16.C
N$44
  Top 0.203: U5.4 49.91,21.59 51.31,20.19 51.31,18.41 51.05,18.16 RA1.B1
N$45
  Top 0.203: U5.5 49.93,20.94 50.8,20.07 50.8,18.54 50.55,18.29 RA1.C1
N$46
  Top 0.203: U5.6 49.94,20.29 50.29,19.94 50.29,18.67 50,18.38 RA1.D1
N$47
  Top 0.203: U5.10 54.09,20.94 53.85,20.7 53.85,18.67 54.14,18.38 RA2.A1
N$48
  Top 0.203: U5.11 54.1,21.59 53.34,20.83 53.34,18.54 53.59,18.29 RA2.B1
N$49
  Top 0.203: U5.12 54.12,22.24 52.83,20.95 52.83,18.41 53.09,18.16 RA2.C1
N$50
  Top 0.203: U6.1 57.32,23.54 56.67,22.89 U5.13 54.13,22.89 52.32,21.08 52.32,18.29 52.54,18.07 RA2.D1
N$51
  Top 0.203: RA4.C2 63.25,15.87 65.28,13.84 65.28,10.03 62.36,7.11 61.09,7.11 59.52,5.54 LED11.2
N$52
  Top 0.203: RA4.B2 63.75,16.01 65.79,13.97 65.79,9.91 62.4,6.52 LED11.4
N$53
  Top 0.203: RA4.A2 64.3,16.09 66.29,14.1 66.29,9.78 63.84,7.33 LED11.5
N$54  (via drill 0.6)
  Top 0.254: v63.5,52.7 63.5,54.76 CN2.S1
N$55  (via drill 0.6)
  Top 0.254: v73.91,52.7 73.91,54.76 CN2.S2
N$57  (via drill 0.6)
  Top 0.254: v36.45,52.7 36.45,54.76 CN1.S2
N$59
  Top 0.203: U6.3 60.06,22.24 61.98,20.32 61.98,18.41 61.76,18.2 RA3.A1
N$60
  Top 0.203: U6.4 60.07,21.59 61.47,20.19 61.47,18.54 61.21,18.28 RA3.B1
N$61
  Top 0.203: U6.5 60.09,20.94 60.96,20.07 60.96,18.67 60.71,18.42 RA3.C1
N$62
  Top 0.203: U6.6 60.1,20.29 60.45,19.94 60.45,18.8 60.16,18.5 RA3.D1
N$63
  Top 0.203: U6.10 64.25,20.94 64.01,20.7 64.01,18.8 64.3,18.5 RA4.A1
N$64
  Top 0.203: U6.11 64.14,21.59 63.5,20.95 63.5,18.67 63.75,18.42 RA4.B1
N$65
  Top 0.203: U6.12 64.15,22.24 62.99,21.08 62.99,18.54 63.25,18.28 RA4.C1
N$66
  Top 0.203: U6.13 64.17,22.89 62.48,21.21 62.48,18.41 62.7,18.2 RA4.D1
N$75
  Top 0.203: RA7.D2 47.16,13.29 LED17.C
N$100
  Top 0.203: U2.5 22.75,36.31 21.46,37.59 19.56,37.59 19.05,38.1 17.14,38.1 16.51,38.73 16.51,40.64 J1.5
SR_CLK  (via drill 0.6)
  Top 0.203: U2.25 34.63,32.81 34.92,32.51 34.92,27.3 36.2,26.04 v36.2,24.89 35.81,24.89 35.31,24.38 R8.2 34.84,24.38 v33.4,24.38 | U8.2 26.32,25.75 26.8,25.27 26.8,24.64 27.3,24.13 v28.57,24.13 | U7.2 73.38,34.65 72.52,33.78 72.52,28.57 69.6,25.65 68.96,25.65 67.69,24.38 67.69,20.19 v66.8,19.3 66.47,19.64 U6.8 | U5.8 56.31,19.64 v56.64,19.3 | U4.8 46.15,19.64 v46.48,19.3
  Bottom 0.203: v33.4,24.38 28.83,24.38 v28.57,24.13 | v66.8,19.3 66.42,19.68 57.02,19.68 v56.64,19.3 56.26,19.68 46.86,19.68 v46.48,19.3 46.1,19.68 40.64,19.68 36.2,24.13 v36.2,24.89
SR_DI1  (via drill 0.6)
  Top 0.203: U2.28 35.67,34.31 v36.32,33.66 | v41.91,28.83 42.67,28.07 46.99,28.07 v47.37,28.45 | v51.69,26.29 52.2,26.29 53.09,27.18 69.22,27.18 70.61,28.57 v70.61,29.21 | U7.7 76.1,31.39 75.82,31.11 v75.82,29.72
  Bottom 0.203: v36.32,33.66 37.08,33.66 v41.91,28.83 | v47.37,28.45 47.37,25.91 48.77,24.51 49.91,24.51 v51.69,26.29 | v70.61,29.21 75.31,29.21 v75.82,29.72
SR_DI2  (via drill 0.6)
  Top 0.203: U2.23 31.46,30.14 31.88,29.72 v32.51,29.72 | v31.37,27.43 31.5,27.43 32.13,26.8 32.13,22.1 31.89,21.86 U8.9
  Bottom 0.203: v31.37,27.43 32.51,28.57 v32.51,29.72
SR_DO
  Top 0.203: U2.27 34.9,33.81 35.94,32.77 35.94,27.56 38.91,24.59 U4.1
SW1  (via drill 0.6)
  Top 0.203: U8.3 23.84,25.11 22.86,24.13 22.86,23.24 v22.48,22.86 21.21,21.59 15.62,21.59 14,19.97 SW1.A2
  Bottom 0.203: R36.1 23.5,23.88 v22.48,22.86
SW2  (via drill 0.6)
  Top 0.203: U8.4 23.82,24.45 23.37,24 23.37,22.1 v22.86,21.59 22.86,21.08 22,20.22 SW2.A1
  Bottom 0.203: R37.1 24.38,23.88 23.37,22.86 23.37,22.1 v22.86,21.59
SW3  (via drill 0.6)
  Top 0.203: U8.6 25.87,23.16 26.16,22.86 26.16,21.46 v26.42,21.21 26,20.79 SW3.B2
  Bottom 0.203: R39.1 25.27,23.5 26.16,22.61 26.16,21.46 v26.42,21.21
SW4  (via drill 0.6)
  Top 0.203: SW4.A2 22,12.98 24.26,15.24 25.91,15.24 27.05,16.38 27.05,20.57 27.3,20.83 27.3,22.1 v27.05,22.35 27.05,22.61 25.85,23.8 U8.5
  Bottom 0.203: R38.1 26.16,23.24 v27.05,22.35
SW5
  Top 0.203: U2.46 27.46,41.12 21.72,46.86 21.72,51.94 20.95,52.7 15.24,52.7 13.6,54.34 SW5.B1
SW6
  Top 0.203: U7.13 85.92,33.34 86.92,34.34 R30.1 87,34.92 89.15,37.08 89.15,49.53 86.4,52.28 SW6.B2
SW7
  Top 0.203: SW7.A2 76.96,22.86 78.87,24.77 78.87,31.75 77.92,32.7 U7.5 76.13,32.7 75.56,32.13 R34.1
SW8
  Top 0.203: SW8.A2 77.9,11.86 79.88,13.84 79.88,32 77.89,33.99 U7.3 75.06,33.99 R32.1
SW9
  Top 0.203: SW9.B2 78.36,27.22 78.36,31.62 77.94,32.05 U7.6 76.11,32.05 75.31,31.24 R35.1
SW10
  Top 0.203: SW10.B2 78,17.04 79.38,18.41 79.38,31.88 77.91,33.34 U7.4 76.14,33.34 75.82,33.02 R33.1
SW11
  Top 0.203: R29.1 84.96,28.83 86,29.87 SW11.B2 86,31.86 85.16,32.7 U7.12
SW12
  Top 0.203: SW12.B2 86,20.93 85.09,21.84 85.09,27.23 R28.1 84.07,27.94 83.82,28.19 83.82,29.21 84.07,29.46 84.71,29.46 85.09,29.84 85.09,31.5 84.54,32.05 U7.11
SW13
  Top 0.203: U2.45 27.96,41.26 22.23,46.99 22.23,54.12 SW13.B1
SW14
  Top 0.203: U7.14 85.94,33.99 86.36,34.42 86.36,35.43 86.74,35.81 R31.1 87.25,35.81 88.65,37.21 88.65,49.4 83.6,54.45 SW14.B1
VBUS  (via drill 0.6)
  Top 0.203: U3.20 82.25,48.87 C20.1 82.28,49.03 81.41,49.91 79.76,49.91 78.11,48.26 76.2,48.26 74.55,46.61 v72.39,46.61 | v66.67,43.81 66.67,45.25 D1.C
  Top 0.381: C2.1 32.87,47.36 | 32.87,47.36 CN1.1 | 32.87,47.36 43.57,47.36 45.73,45.2 FB1.1 49.54,45.2 51.31,43.43 64.39,43.43 66.2,45.25 D1.C
  Bottom 0.203: v72.39,46.61 69.47,46.61 v66.67,43.81
X_ASSOC
  Top 0.203: CN3.15 65.78,36.46 66.04,36.2 66.04,33.77 LED13.A
X_COMBTN  (via drill 0.6)
  Top 0.254: v62.99,45.21 62.99,46.46 CN3.20
X_ON
  Top 0.203: CN3.13 62.94,32.46 65.29,34.81 LED12.A
X_RSSI
  Top 0.203: LED14.A 64.15,31.62 49.02,31.62 44.19,36.46 CN3.6
X_RX  (via drill 0.6)
  Top 0.203: U2.43 28.96,39.12 v28.32,38.48 | CN3.2 36.84,44.46 v34.29,41.91
  Bottom 0.203: v34.29,41.91 30.86,38.48 v28.32,38.48
X_TX
  Top 0.203: U2.35 34.63,37.81 36.07,39.24 39.37,39.24 40.25,40.12 CN3.3